# EAGLE design Jetson Nano (EAGLE 9.6.2)
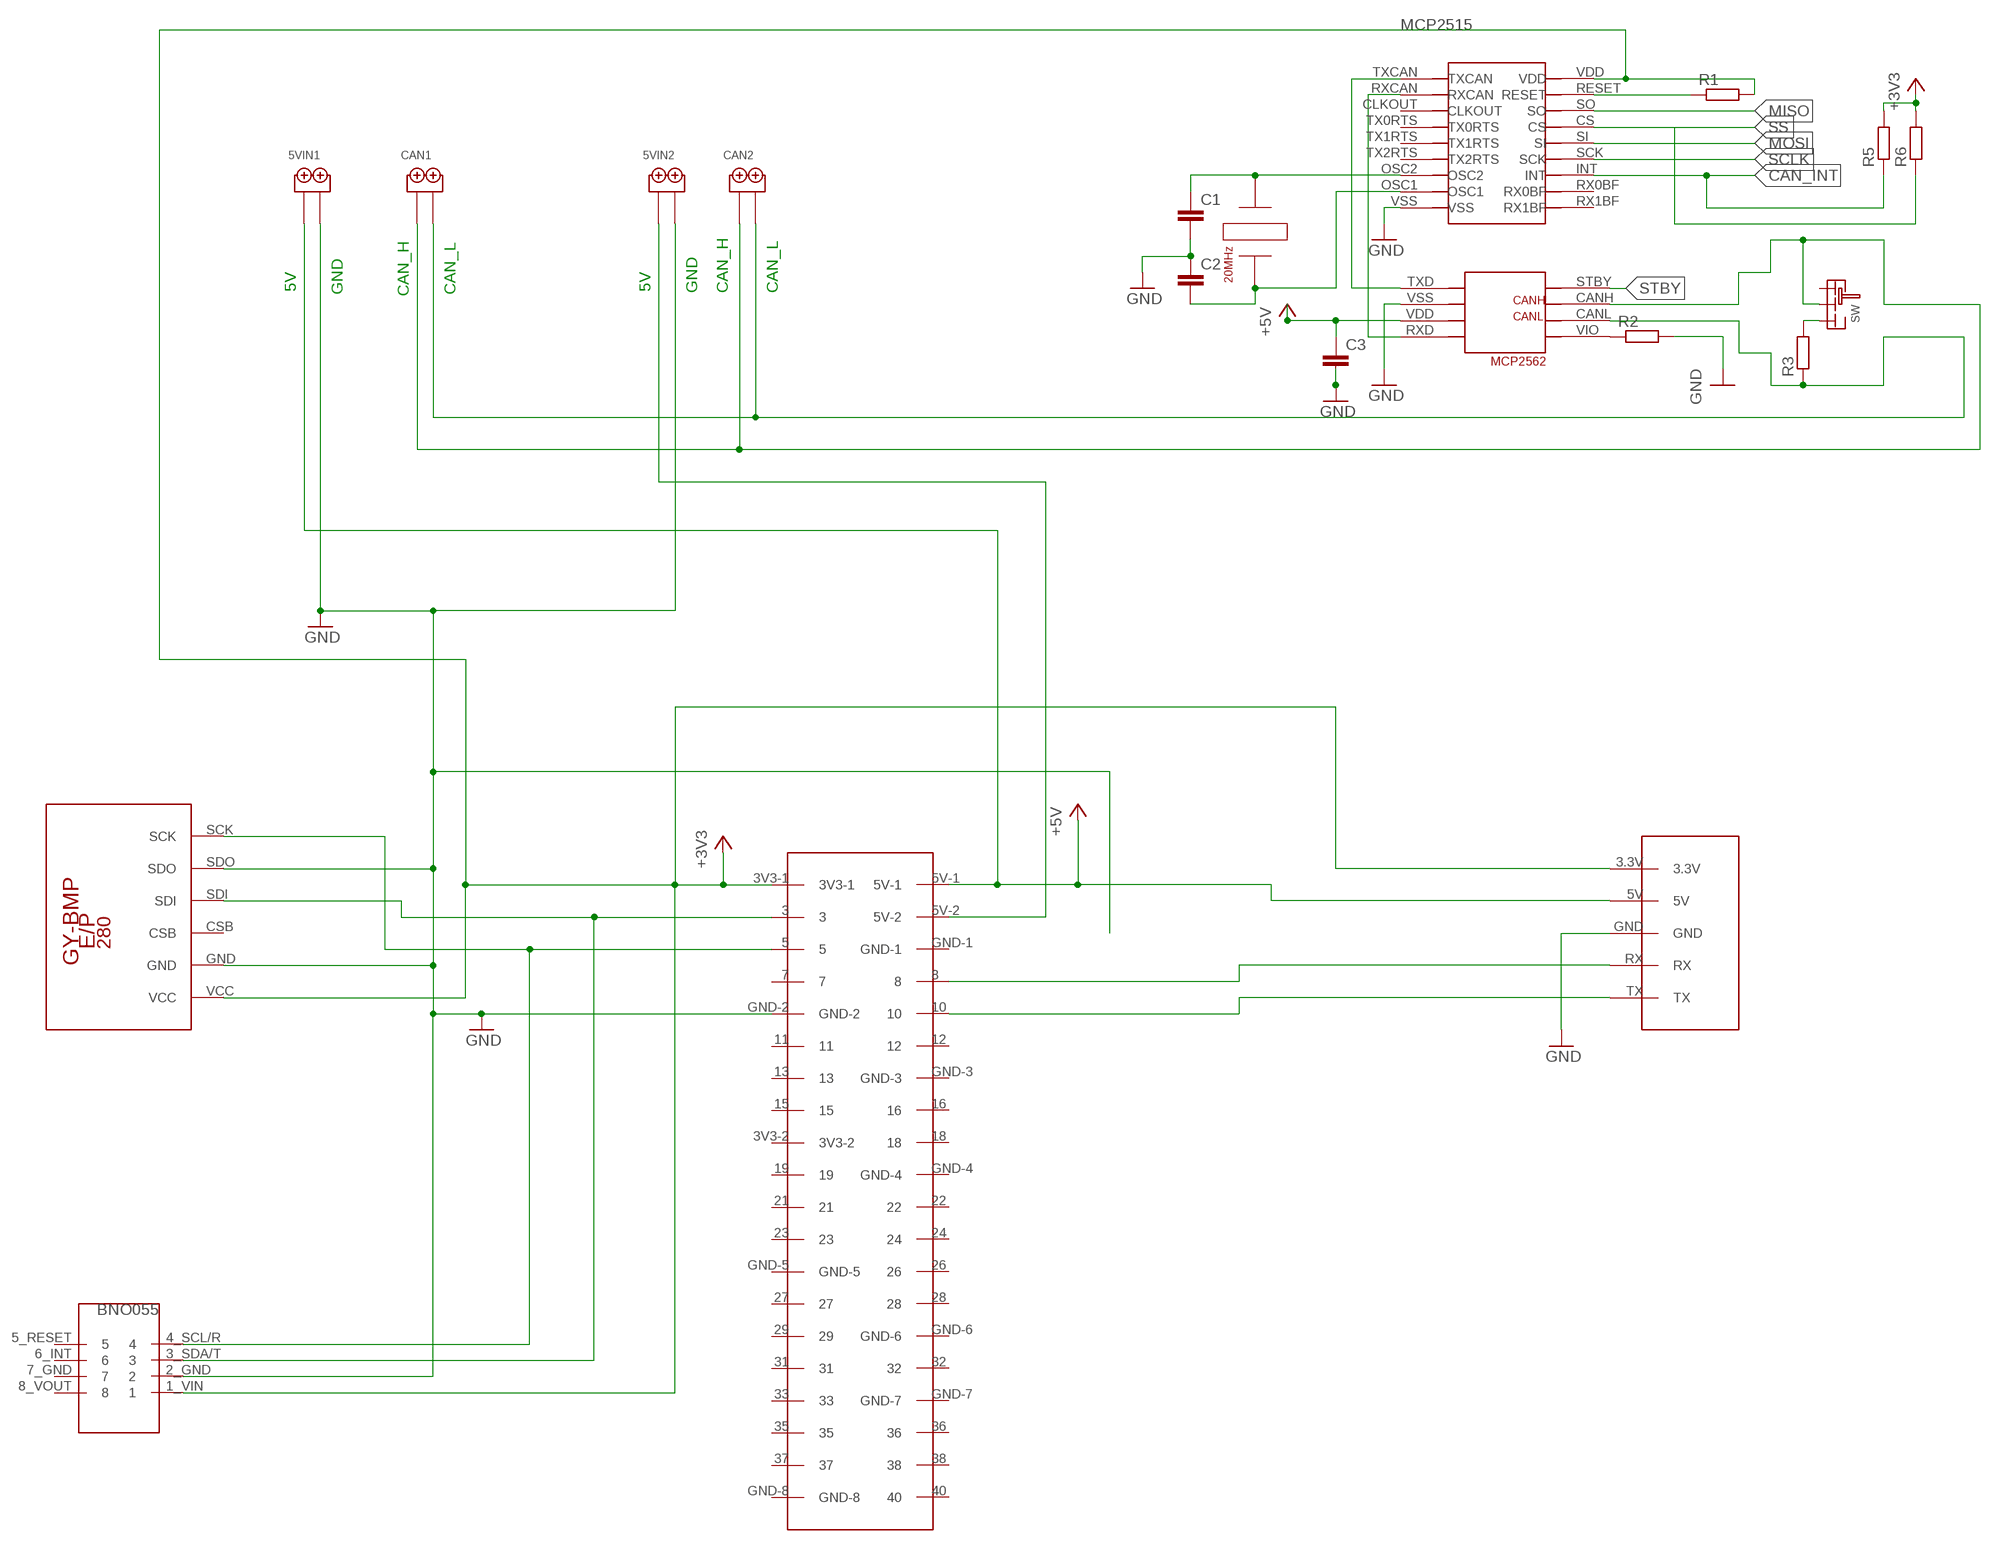
[diagram p0: schematic, sheet 1]

## Parts
5VIN1  2PIN  [2PIN]
5VIN2  2PIN  [2PIN]
C1  C-EU025-024X044  [C025-024X044]
C2  C-EU025-024X044  [C025-024X044]
C3  C-EU025-024X044  [C025-024X044]
CAN1  2PIN  [2PIN]
CAN2  2PIN  [2PIN]
JN1  JETSON_NANO  [JETSON_NANO]
MCP1  MCP2515  [MCP2515]
R1  R-EU_0207/10  [0207/10]
R2  R-EU_0207/10  [0207/10]
R3  R-EU_0207/10  [0207/10]
R5  R-EU_0207/10  [0207/10]
R6  R-EU_0207/10  [0207/10]
SW  SRIDE_SWITCH  [SRIDE_SWITCH]
U$1  GY-BPM280  [GY-BMP280-FOOTPRINT]
U$2  BNO055  [BNO055]
U$3  WIRELESS_PINS  [WIRELESS_PINS]
U$4  MCP2562  [MCP2562]
U$5  HUSG20  [HUSG20]

## Nets
5V_2 [PW]: 5VIN2.P$1 JN1.5V-2
+3V3: JN1.3V3-1 MCP1.VDD R1.2 R5.2 R6.2 U$1.VCC U$2.1_VIN U$3.3.3V
+5V_1 [PW]: 5VIN1.P$1 C3.1 JN1.5V-1 U$3.5V U$4.VDD ; supply symbol labelled +5V
CAN_H2 [CAN]: CAN1.P$1 CAN2.P$1 SW.LR U$4.CANH
CAN_INT [CAN]: MCP1.INT R5.1
GND [PW]: 5VIN1.P$2 5VIN2.P$2 C1.2 C2.1 C3.2 JN1.GND-2 MCP1.VSS U$1.GND U$1.SDO U$2.2_GND U$3.GND U$4.VSS
MISO: MCP1.SO
MOSI: MCP1.SI
N$1 [CAN]: R2.2 ; supply symbol labelled GND
N$3: JN1.3 U$1.SDI U$2.3_SDA/T
N$4: JN1.5 U$1.SCK U$2.4_SCL/R
N$5: C1.1 MCP1.OSC2 U$5.A
N$7: C2.2 MCP1.OSC1 U$5.B
N$8: MCP1.TXCAN U$4.TXD
N$10: MCP1.RXCAN U$4.RXD
N$11: JN1.8 U$3.RX
N$12: JN1.10 U$3.TX
N$13: MCP1.RESET R1.1
N$14: R2.1 U$4.VIO
N$15: R3.2 SW.R
N$16: CAN1.P$2 CAN2.P$2 R3.1 U$4.CANL
SCLK: MCP1.SCK
SS: MCP1.CS R6.1
STBY: U$4.STBY
Unconnected: JN1.3V3-2 JN1.7 JN1.11 JN1.12 JN1.13 JN1.15 JN1.16 JN1.18 JN1.19 JN1.21 JN1.22 JN1.23 JN1.24 JN1.26 JN1.27 JN1.28 JN1.29 JN1.31 JN1.32 JN1.33 JN1.35 JN1.36 JN1.37 JN1.38 JN1.40 JN1.GND-1 JN1.GND-3 JN1.GND-4 JN1.GND-5 JN1.GND-6 JN1.GND-7 JN1.GND-8 MCP1.CLKOUT MCP1.RX0BF MCP1.RX1BF MCP1.TX0RTS MCP1.TX1RTS MCP1.TX2RTS SW.L U$1.CSB U$2.5_RESET U$2.6_INT U$2.7_GND U$2.8_VOUT

## Notes on the sheet
- 5V | GND | CAN_L | 5V | GND | CAN_H | CAN_L
- CAN_H

## Library data of the parts
5VIN1 5VIN2 CAN1 CAN2 = TB113-2B-x-x-0-x-x:2PIN
C1-C3 = rcl:C-EU: CAPACITOR, European symbol; SPICEPREFIX: C
JN1 = Jetson_Nano_GPIO:JETSON_NANO: Jetson Nano GPIO
MCP1 = MCP2515:MCP2515
R1-R3 R5 R6 = rcl:R-EU_: RESISTOR, European symbol; SPICEPREFIX: R
SW = Sride Switch:SRIDE_SWITCH
U$1 = BMP280:GY-BPM280
U$2 = BNO055:BNO055
U$3 = Wireless_Pins:WIRELESS_PINS
U$4 = MCP2562:MCP2562
U$5 = HUSG20:HUSG20

## Net classes
0 default: width 0.61 mm
1 PW: width 2.286 mm, clearance 0.508 mm
2 CAN: width 0.61 mm, clearance 0.127 mm

## Board
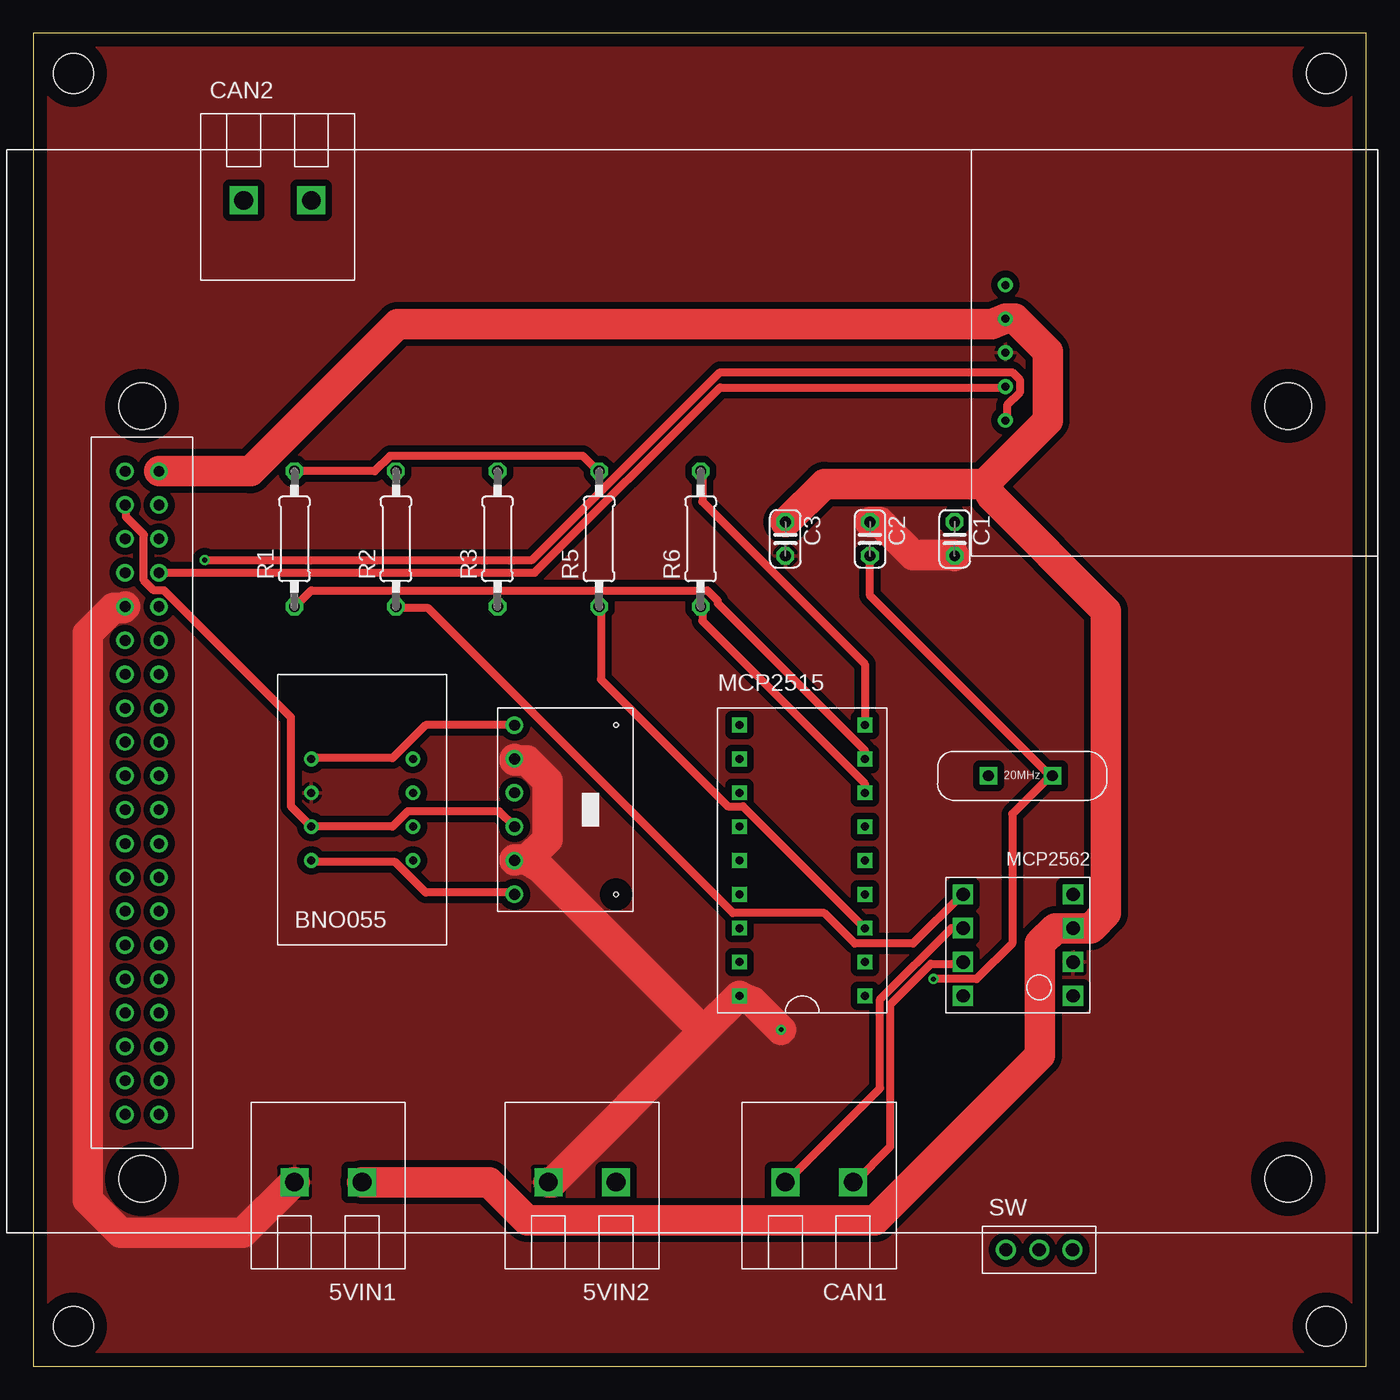
[diagram p1: board, top side]
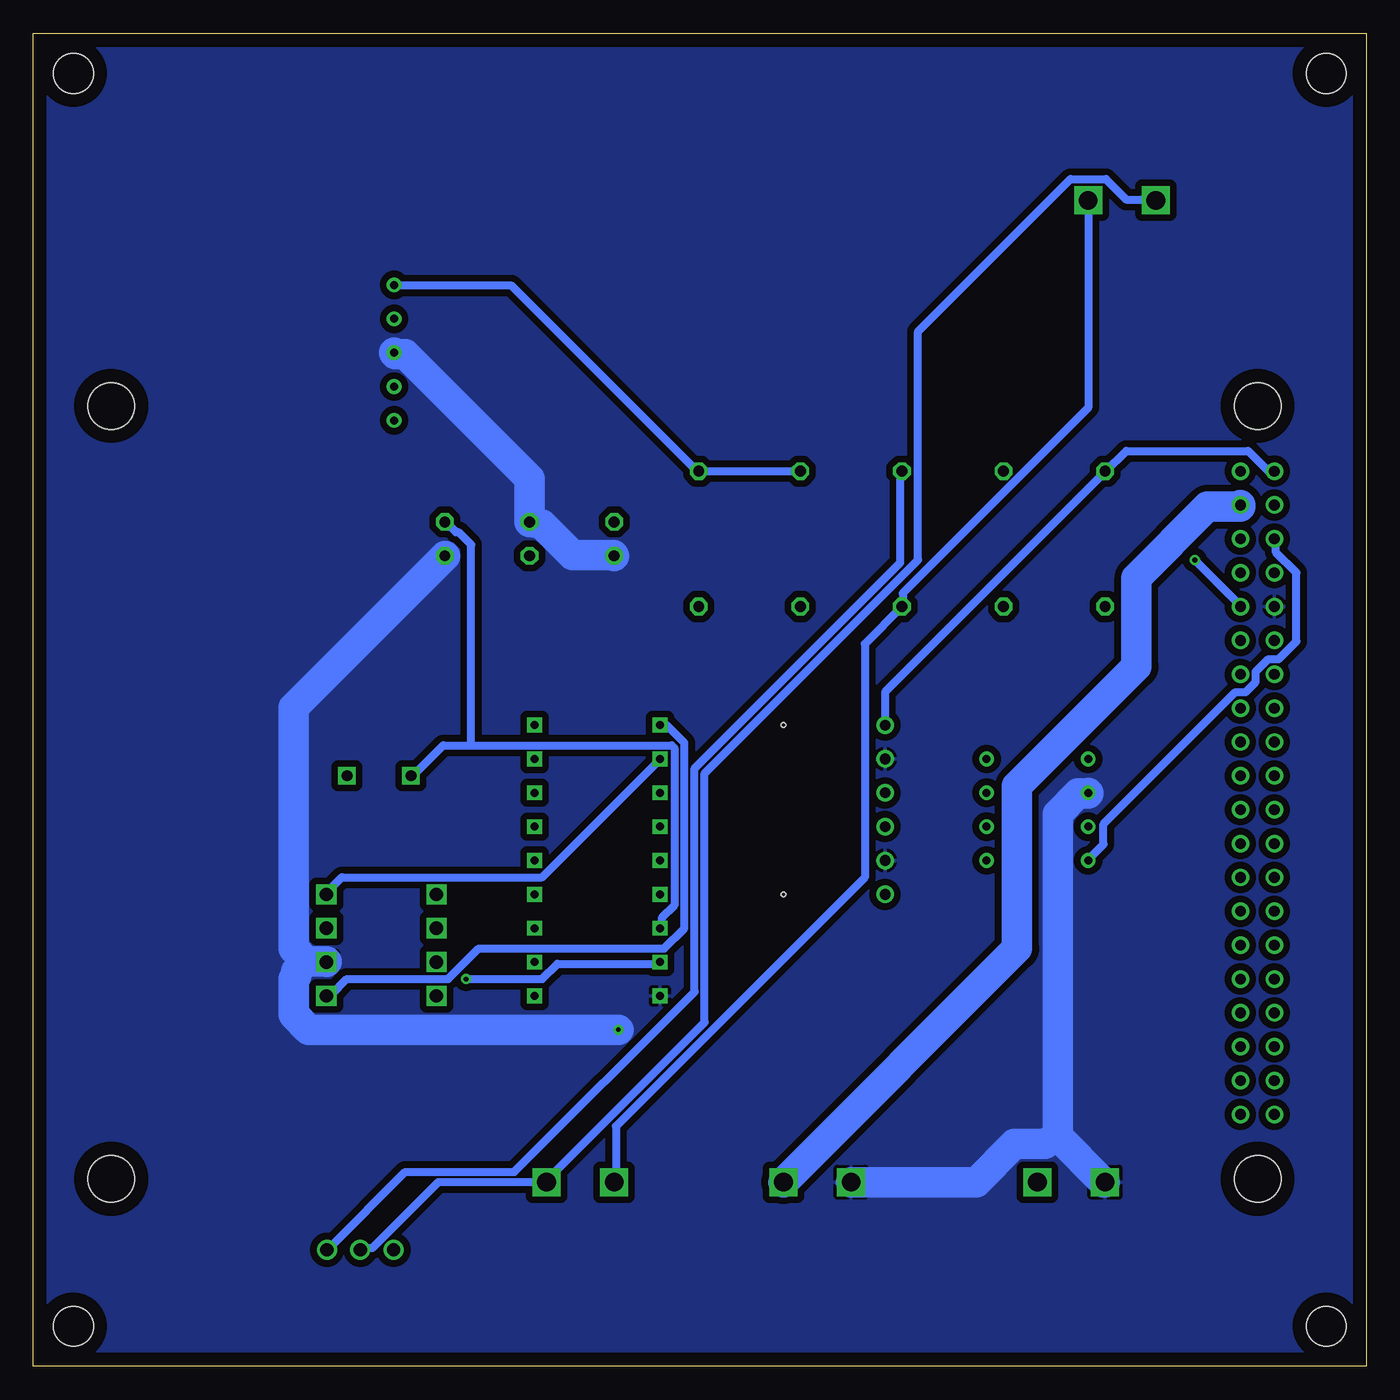
[diagram p2: board, bottom side, seen from below]

Size 100 x 100 mm. Coordinates in mm from the lower left corner, seen from the top.
Outline: 0,0 100,0 100,100 0,100 0,0
Copper layers (1*16): Top 0.035mm / dielectric 1.5mm / Bottom 0.035mm
Design rules "default": minimum track width 6mil, minimum drill 0.35mm, track to track 6mil, track to pad 6mil, pad to pad 6mil, via to via 6mil, smd to smd 6mil, copper to edge 40mil, drill to drill 6mil, minimum pad ring 10mil, minimum via ring 8mil, stop-mask expansion 4mil, vias tented up to drill 0mil, thermal gap 10mil
Holes 3 mm at 3,97 97,97 97,3 3,3
Holes 3.5 mm at 8.15,14.05 8.15,72.05 94.15,72.05 94.15,14.05

### Footprints (pad centres in the part's own frame; a part is rotated, then mirrored left to right if it is on the bottom)
2PIN = drill 1.4 square: P$1 -2.54,0; P$2 2.54,0
C025-024X044 = drill 0.813 octagon: 1 -1.27,0; 2 1.27,0
JETSON_NANO = drill 0.8: 3 0,45.72; 3V3-1 0,48.26; 3V3-2 0,27.94; 5 0,43.18; 5V-1 2.54,48.26; 5V-2 2.54,45.72; 7 0,40.64; 8 2.54,40.64; 10 2.54,38.1; 11 0,35.56; 12 2.54,35.56; 13 0,33.02; 15 0,30.48; 16 2.54,30.48; 18 2.54,27.94; 19 0,25.4; 21 0,22.86; 22 2.54,22.86; 23 0,20.32; 24 2.54,20.32; 26 2.54,17.78; 27 0,15.24; 28 2.54,15.24; 29 0,12.7; 31 0,10.16; 32 2.54,10.16; 33 0,7.62; 35 0,5.08; 36 2.54,5.08; 37 0,2.54; 38 2.54,2.54; 40 2.54,0; GND-1 2.54,43.18; GND-2 0,38.1; GND-3 2.54,33.02; GND-4 2.54,25.4; GND-5 0,17.78; GND-6 2.54,12.7; GND-7 2.54,7.62; GND-8 0,0
MCP2515 = drill 0.6 square: CLKOUT -4.7,5.08; CS 4.7,5.08; INT 4.7,-5.08; OSC1 -4.7,-7.62; OSC2 -4.7,-5.08; RESET 4.7,7.62; RX0BF 4.7,-7.62; RX1BF 4.7,-10.16; RXCAN -4.7,7.62; SCK 4.7,-2.54; SI 4.7,0; SO 4.7,2.54; TX0RTS -4.7,2.54; TX1RTS -4.7,0; TX2RTS -4.7,-2.54; TXCAN -4.7,10.16; VDD 4.7,10.16; VSS -4.7,-10.16
0207/10 = drill 0.813 octagon: 1 -5.08,0; 2 5.08,0
SRIDE_SWITCH = drill 1: L -2.5,0; LR 0,0; R 2.5,0
GY-BMP280-FOOTPRINT = drill 0.8: CSB 6.35,0; GND 3.81,0; SCK 13.97,0; SDI 8.89,0; SDO 11.43,0; VCC 1.27,0 | hole 0.35: 1.27,7.62; 13.97,7.62
BNO055 = drill 0.6: 1_VIN 6.35,1.27; 2_GND 8.89,1.27; 3_SDA/T 11.43,1.27; 4_SCL/R 13.97,1.27; 5_RESET 13.97,8.89; 6_INT 11.43,8.89; 7_GND 8.89,8.89; 8_VOUT 6.35,8.89
WIRELESS_PINS = drill 0.6: 3.3V -5.08,0; 5V -2.54,0; GND 0,0; RX 2.54,0; TX 5.08,0
MCP2562 = drill 1 square: CANH 8.255,6.35; CANL 8.255,3.81; RXD 0,1.27; STBY 8.255,8.89; TXD 0,8.89; VDD 0,3.81; VIO 8.255,1.27; VSS 0,6.35
HUSG20 = drill 0.8 square: A 1.27,0; B 6.07,0

### Placement (x,y rotation side)
5VIN1  22.13,13.81 180 top
5VIN2  41.18,13.81 180 top
C1  69.12,62.07 270 top
C2  62.77,62.07 270 top
C3  56.42,62.07 270 top
CAN1  58.96,13.81 180 top
CAN2  18.32,87.47 0 top
JN1  6.89,18.89 0 top
MCP1  57.69,37.94 0 top
R1  19.59,62.07 90 top
R2  27.21,62.07 90 top
R3  34.83,62.07 90 top
R5  42.45,62.07 90 top
R6  50.07,62.07 90 top
SW  75.47,8.73 0 top
U$1  36.1,49.37 270 top
U$2  19.59,51.91 270 top
U$3  72.93,76.04 270 top
U$4  78.01,36.67 180 top
U$5  70.39,44.29 0 top

### Tracks (layer width: path | path; a pad name or v marks a point on that pad's centre or on a via)
5V_2
  Bottom 2.286: 5VIN2.P$1 26.19,31.34 26.19,43.53 17.24,52.48 17.24,59.15 11.91,64.48 9.43,64.48 JN1.5V-2
+3V3
  Top 0.61: U$1.VCC 29.43,48.1 26.96,45.62 20.86,45.62 U$2.1_VIN | MCP1.VDD 62.39,52.67 50.2,64.86 50.2,67.15 R6.2 | R1.2 25.62,67.15 26.77,68.29 41.24,68.29 42.39,67.15 R5.2
  Bottom 0.61: JN1.3V3-1 7.33,67.15 8.86,68.67 18,68.67 19.53,67.15 R1.2 19.72,66.96 36.1,50.58 U$1.VCC | U$3.3.3V 72.87,81.06 64.1,81.06 50.2,67.15 R6.2 R5.2
+5V_1
  Top 2.286: 71.34,66.2 76.11,70.96 76.11,76.1 73.63,78.58 U$3.5V 71.91,78.2 27.34,78.2 16.29,67.15 JN1.5V-1 | 71.34,66.2 59.34,66.2 56.48,63.34 C3.1 | 71.34,66.2 71.91,65.25 80.49,56.67 80.49,34 79.34,32.86 U$4.VDD 76.68,32.86 75.53,31.72 75.53,23.34 63.15,10.95 37.05,10.95 34.2,13.81 5VIN1.P$1
CAN_H2
  Top 0.61: U$4.CANH 69.63,30.19 67.34,30.19 64.29,27.14 64.29,16.48 61.63,13.81 CAN1.P$1
  Bottom 0.61: SW.LR 75.34,8.86 74.58,8.86 69.63,13.81 CAN1.P$1 61.44,14 49.63,25.81 49.63,44.48 33.62,60.48 33.62,77.63 22.19,89.06 19.53,89.06 18,87.53 15.91,87.53 CAN2.P$1
CAN_INT
  Top 0.61: MCP1.INT 53.24,42 52.1,42 42.58,51.53 42.58,56.86 R5.1
GND  (via drill 0.35)
  Top 2.286: C2.1 63.53,63.34 66.01,60.86 69.06,60.86 C1.2 | 37.05,38 36.1,38 U$1.SDO | 37.05,38 38.58,39.53 38.58,43.91 37.05,45.43 36.1,45.43 U$1.GND | 50.29,25.14 38.96,13.81 5VIN2.P$2 | 50.29,25.14 52.86,27.72 MCP1.VSS 54.01,27.34 v56.1,25.24 | 50.29,25.14 38.01,37.43 37.05,38 | JN1.GND-2 6.76,56.86 6,56.86 4.1,54.96 4.1,12.48 6.57,10 15.72,10 19.53,13.81 5VIN1.P$2
  Bottom 2.286: U$3.GND 72.87,75.91 72.11,75.91 62.77,66.58 C2.1 61.82,63.15 59.53,60.86 56.48,60.86 C3.2 | 79.53,30.38 78.01,30.38 U$4.VSS | 79.53,30.38 80.49,31.34 80.49,49.43 C1.2 | 23.15,17.24 23.15,41.43 21.62,42.96 20.86,42.96 U$2.2_GND | 23.15,17.24 19.72,13.81 5VIN1.P$2 | 5VIN2.P$2 29.24,13.81 26.38,16.67 24.1,16.67 23.15,17.24 | v56.1,25.24 79.34,25.24 80.49,26.38 80.49,29.05 80.3,29.24 80.3,29.62 79.53,30.38
  pour Top: -8.89,103.98 109.22,103.98 114.3,98.9 114.3,1.11 109.22,-3.97 -10.16,-3.97 -15.24,1.11 -15.24,97.63
  pour Bottom: -10.16,106.52 109.22,106.52 116.84,98.9 116.84,2.38 107.95,-6.51 -10.16,-6.51 -17.78,1.11 -17.78,98.9
N$3
  Top 0.61: U$1.SDI 34.96,41.62 28.1,41.62 26.96,40.48 U$2.3_SDA/T 19.34,42 19.34,48.67 9.81,58.2 9.05,58.2 8.29,58.96 8.29,62.39 6.95,63.72 6.95,64.48 JN1.3
N$4
  Top 0.61: U$2.4_SCL/R 20.86,37.81 27.15,37.81 29.43,35.53 36.1,35.53 U$1.SCK
  Bottom 0.61: JN1.5 6.76,62.01 6.76,61.05 5.24,59.53 5.24,54.39 6.57,53.05 7.33,53.05 8.29,52.1 8.29,51.34 9.05,50.58 9.81,50.58 19.72,40.67 19.72,39.15 20.86,38 U$2.4_SCL/R
N$5
  Bottom 0.61: 67.15,46.58 69.25,46.58 71.53,44.29 U$5.A | 67.15,46.58 52.1,46.58 51.91,46.39 51.91,34.58 52.86,33.62 52.86,32.86 MCP1.OSC2 | 67.15,46.58 67.15,61.63 68.1,62.58 68.29,62.58 69.06,63.34 C1.1
N$7  (via drill 0.35)
  Top 0.61: v67.53,29.05 70.77,29.05 73.44,31.72 73.44,41.43 76.3,44.29 U$5.B 76.11,44.48 62.77,57.82 C2.2
  Bottom 0.61: v67.53,29.05 61.82,29.05 60.67,30.19 53.05,30.19 MCP1.OSC1
N$8
  Bottom 0.61: MCP1.TXCAN 52.48,48.1 51.15,46.77 51.15,32.86 52.67,31.34 66.58,31.34 68.87,29.05 76.49,29.05 77.63,27.91 78.01,27.91 U$4.TXD
N$10
  Bottom 0.61: MCP1.RXCAN 53.05,45.43 61.82,36.67 76.87,36.67 78.01,35.53 U$4.RXD
N$11
  Top 0.61: JN1.8 37.62,59.53 51.53,73.44 72.87,73.44 U$3.RX
N$12  (via drill 0.35)
  Top 0.61: v12.86,60.48 37.43,60.48 51.53,74.58 73.44,74.58 74.01,74.01 74.01,73.06 73.06,72.1 73.06,70.96 U$3.TX
  Bottom 0.61: v12.86,60.48 9.43,57.05 JN1.10
N$13
  Top 0.61: MCP1.RESET 62.39,45.62 62.39,46.2 51.34,57.24 51.34,57.43 50.58,58.2 20.86,58.2 19.72,57.05 R1.1
N$14
  Top 0.61: R2.1 27.34,56.86 29.62,56.86 52.48,34 59.34,34 61.63,31.72 66.01,31.72 69.63,35.34 U$4.VIO
N$15
  Bottom 0.61: R3.2 34.96,67.15 34.96,60.29 50.39,44.86 50.39,28.1 63.91,14.57 72.11,14.57 77.82,8.86 SW.R
N$16
  Top 0.61: U$4.CANL 68.87,32.86 63.53,27.53 63.53,20.86 56.48,13.81 CAN1.P$2
  Bottom 0.61: CAN2.P$2 20.86,71.91 34.77,58.01 34.77,57.05 R3.1 37.62,54.2 37.62,36.67 56.29,18 56.29,13.81 CAN1.P$2
SS
  Top 0.61: MCP1.CS 62.39,43.15 62.39,43.72 50.2,55.91 50.2,56.86 R6.1